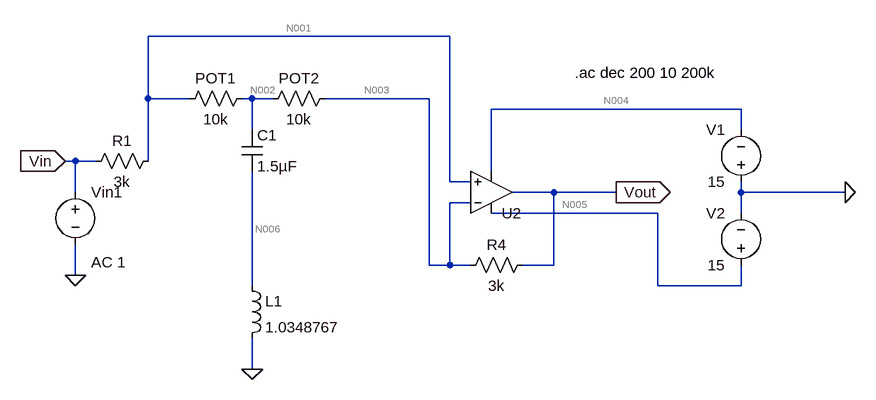
[diagram p0: schematic Draft2.asc]
Draft2.asc, the LTspice schematic file:
Version 4.1
SHEET 1 1108 680
WIRE 480 -96 16 -96
WIRE 16 0 16 -96
WIRE 80 0 16 0
WIRE 176 0 160 0
WIRE 208 0 176 0
WIRE 448 0 288 0
WIRE 928 16 544 16
WIRE 176 48 176 0
WIRE 928 48 928 16
WIRE -96 96 -112 96
WIRE -64 96 -96 96
WIRE 16 96 16 0
WIRE 544 112 544 16
WIRE 480 128 480 -96
WIRE 512 128 480 128
WIRE -96 144 -96 96
WIRE 640 144 576 144
WIRE 736 144 640 144
WIRE 928 144 928 128
WIRE 1088 144 928 144
WIRE 512 160 480 160
WIRE 800 176 544 176
WIRE 928 176 928 144
WIRE 448 256 448 0
WIRE 480 256 480 160
WIRE 480 256 448 256
WIRE 512 256 480 256
WIRE 640 256 640 144
WIRE 640 256 592 256
WIRE -96 272 -96 224
WIRE 176 288 176 112
WIRE 800 288 800 176
WIRE 928 288 928 256
WIRE 928 288 800 288
WIRE 176 416 176 368
FLAG -112 96 Vin
IOPIN -112 96 In
FLAG 736 144 Vout
IOPIN 736 144 Out
FLAG -96 272 0
FLAG 176 416 0
FLAG 1088 144 0
SYMBOL res 32 80 R90
WINDOW 0 0 56 VBottom 2
WINDOW 3 32 56 VTop 2
SYMATTR InstName R1
SYMATTR Value 3k
SYMBOL res 176 -16 R90
WINDOW 0 0 56 VBottom 2
WINDOW 3 32 56 VTop 2
SYMATTR InstName POT1
SYMATTR Value 10k
SYMBOL res 304 -16 R90
WINDOW 0 0 56 VBottom 2
WINDOW 3 32 56 VTop 2
SYMATTR InstName POT2
SYMATTR Value 10k
SYMBOL cap 160 48 R0
SYMATTR InstName C1
SYMATTR Value 1.5µF
SYMBOL OpAmps\\UniversalOpAmp2 544 144 M180
SYMATTR InstName U2
SYMATTR Value2 Avol=1Meg GBW=55Meg Slew=20
SYMATTR SpiceLine Ilimit=25m Rail=0.2 Vos=0.2m
SYMATTR SpiceLine2 En=2.7n Enk=20 In=0.4p Ink=100 Rin=1e9
SYMBOL res 608 240 R90
WINDOW 0 0 56 VBottom 2
WINDOW 3 32 56 VTop 2
SYMATTR InstName R4
SYMATTR Value 3k
SYMBOL voltage -96 128 R0
WINDOW 123 24 124 Left 2
WINDOW 39 0 0 Left 0
SYMATTR Value2 AC 1
SYMATTR InstName Vin1
SYMATTR Value ""
SYMBOL ind 160 272 R0
SYMATTR InstName L1
SYMATTR Value 1.0348767
SYMATTR SpiceLine Rser=510
SYMBOL voltage 928 144 R180
WINDOW 0 24 96 Left 2
WINDOW 3 24 16 Left 2
SYMATTR InstName V1
SYMATTR Value 15
SYMBOL voltage 928 272 R180
WINDOW 0 24 96 Left 2
WINDOW 3 24 16 Left 2
SYMATTR InstName V2
SYMATTR Value 15
TEXT 672 -40 Left 2 !.ac dec 200 10 200k

The netlist it stands for:
* Draft2.asc
R1 N001 Vin 3k
R§POT1 N002 N001 10k
R§POT2 N003 N002 10k
C1 N002 N006 1.5µF
X§U2 N001 N003 N005 N004 Vout level2 Avol=1Meg GBW=55Meg Slew=20 Ilimit=25m Rail=0.2 Vos=0.2m En=2.7n Enk=20 In=0.4p Ink=100 Rin=1e9  ; pins In+ In- V+ V- OUT
R4 Vout N003 3k
Vin1 Vin 0 AC 1
L1 N006 0 1.0348767 Rser=510
V1 0 N004 15
V2 N005 0 15
.ac dec 200 10 200k
.lib UniversalOpAmp2.lib
.backanno
.end

* Results of the author's LTspice run, read from the files saved beside the schematic
* Operating Point, zero values left out:
*   V(n001) = 30 µV
*   V(n002) = 130 µV
*   V(n003) = 230 µV
*   V(n004) = -15 V
*   V(n005) = 15 V
*   V(vout) = 260 µV
*   I(POT1) = 10 nA
*   I(POT2) = 10 nA
*   I(R1) = 10 nA
*   I(R4) = 10 nA
*   I(V1) = -1.477 mA
*   I(V2) = -1.477 mA
*   I(Vin1) = 10 nA
*   Ix(u2:3) = 1.477 mA
*   Ix(u2:4) = -1.477 mA
*   Ix(u2:5) = -10 nA
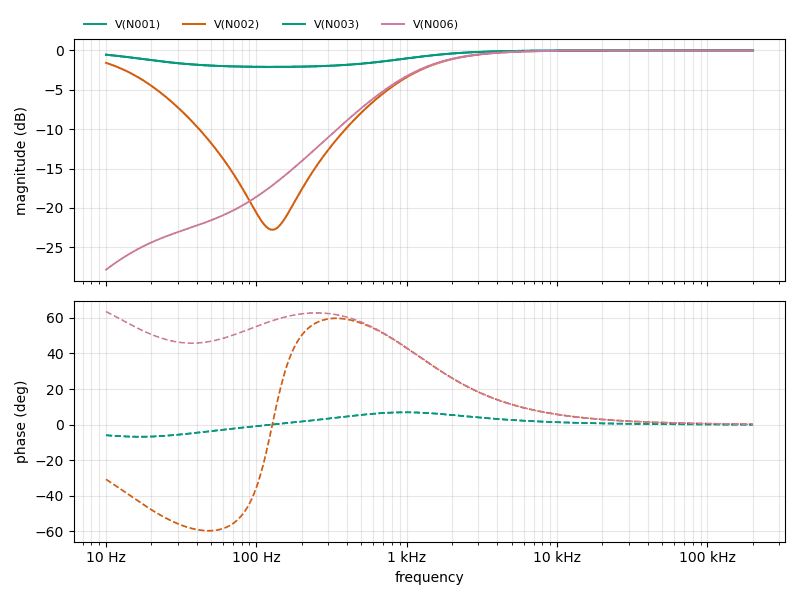
[diagram p1: AC Analysis of Draft2.asc, plotted from the saved traces]
* AC Analysis, 1 run:
*   V(N001): -0.54 dB at 10 Hz, -0.00 dB at 200 kHz, peak -0.00 dB at 200 kHz
*   V(N002): -1.58 dB at 10 Hz, -0.00 dB at 200 kHz, peak -0.00 dB at 200 kHz, 3 dB below the peak at 1.087 kHz
*   V(N003): -0.54 dB at 10 Hz, -0.00 dB at 200 kHz, peak -0.00 dB at 167.9 kHz
*   V(N006): -27.83 dB at 10 Hz, -0.00 dB at 200 kHz, peak -0.00 dB at 200 kHz, 3 dB below the peak at 1.057 kHz